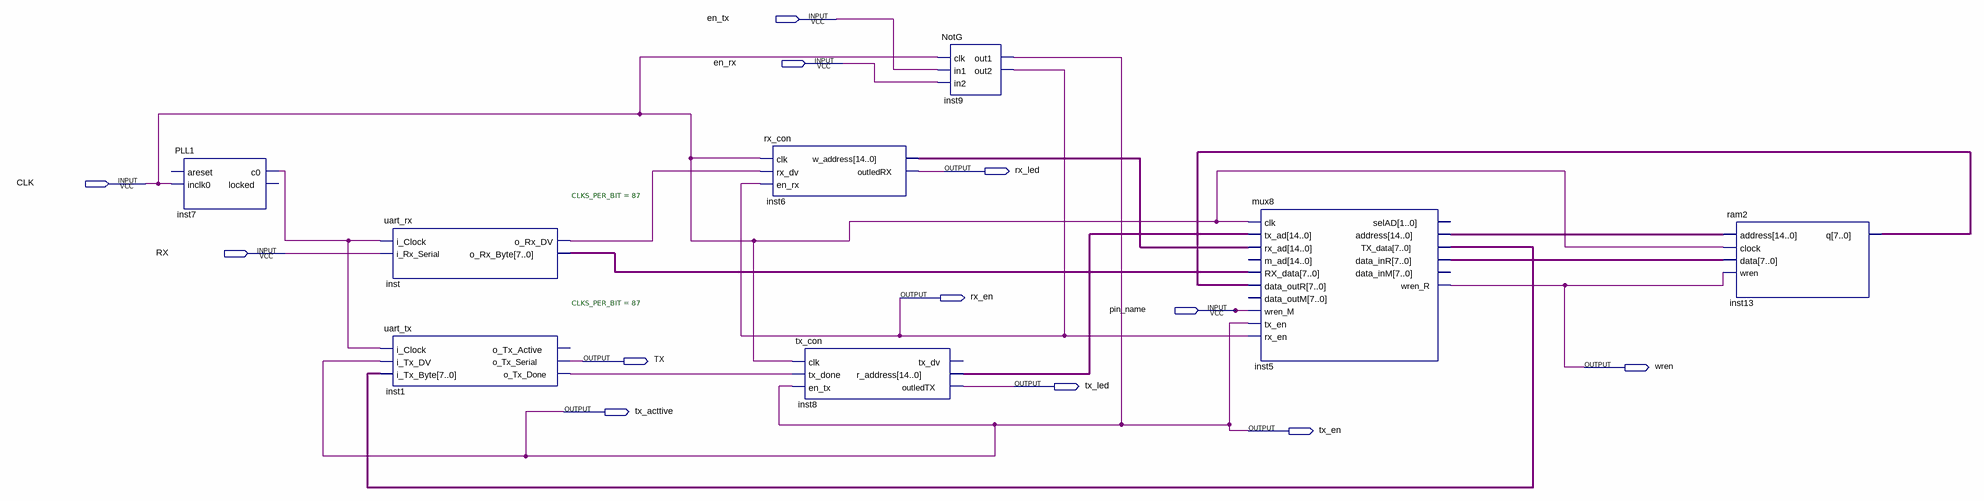
[diagram p0: schematic sheet]
// Quartus schematic uartFpgaBLOCK.bdf as structural Verilog: 8 symbols, 12 pins
module uartFpgaBLOCK (
  input  en_tx,
  input  en_rx,
  input  CLK,
  input  RX,
  input  pin_name,
  output rx_led,
  output rx_en,
  output TX,
  output wren,
  output tx_led,
  output tx_acttive,
  output tx_en
);

  wire inst1_o_tx_done, inst7_c0, inst_o_rx_dv;
  wire [7:0] inst5_data_inr, inst5_tx_data, inst13_q, inst_o_rx_byte;
  wire [14:0] inst5_address, inst6_w_address, inst8_r_address;

  PLL1 inst7 (.inclk0(CLK), .c0(inst7_c0));  // open: areset, locked
  uart_rx #(.CLKS_PER_BIT(87)) inst (
    .i_Clock(inst7_c0), .i_Rx_Serial(RX), .o_Rx_DV(inst_o_rx_dv), .o_Rx_Byte(inst_o_rx_byte));
  uart_tx #(.CLKS_PER_BIT(87)) inst1 (
    .i_Clock(inst7_c0), .i_Tx_DV(tx_acttive), .i_Tx_Byte(inst5_tx_data), .o_Tx_Serial(TX),
    .o_Tx_Done(inst1_o_tx_done));  // open: o_Tx_Active
  rx_con inst6 (.clk(CLK), .rx_dv(inst_o_rx_dv), .en_rx(rx_en), .w_address(inst6_w_address), .outledRX(rx_led));
  tx_con inst8 (
    .clk(CLK), .tx_done(inst1_o_tx_done), .en_tx(tx_acttive), .r_address(inst8_r_address), .outledTX(tx_led));  // open: tx_dv
  NotG inst9 (.clk(CLK), .in1(en_tx), .in2(en_rx), .out1(tx_acttive), .out2(rx_en));
  mux8 inst5 (
    .clk(CLK), .tx_ad(inst8_r_address), .rx_ad(inst6_w_address), .RX_data(inst_o_rx_byte),
    .data_outR(inst13_q), .wren_M(pin_name), .tx_en(tx_acttive), .rx_en(rx_en), .address(inst5_address),
    .TX_data(inst5_tx_data), .data_inR(inst5_data_inr), .wren_R(wren));  // open: m_ad, data_outM, selAD, data_inM
  ram2 inst13 (.address(inst5_address), .clock(CLK), .data(inst5_data_inr), .wren(wren), .q(inst13_q));

  assign tx_en = tx_acttive;
endmodule
